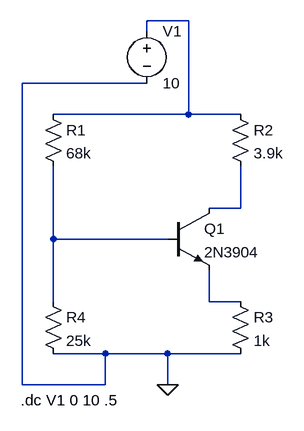
[diagram p0: schematic Lab6Pre1.asc]
Lab6Pre1.asc, the LTspice schematic file:
Version 4
SHEET 1 880 680
WIRE 272 -64 208 -64
WIRE 208 -48 208 -64
WIRE 208 32 16 32
WIRE 272 80 272 -64
WIRE 272 80 64 80
WIRE 352 80 272 80
WIRE 352 224 352 160
WIRE 352 224 304 224
WIRE 64 272 64 160
WIRE 240 272 64 272
WIRE 64 368 64 272
WIRE 304 368 304 320
WIRE 352 368 304 368
WIRE 144 448 64 448
WIRE 240 448 144 448
WIRE 352 448 240 448
WIRE 16 496 16 32
WIRE 144 496 144 448
WIRE 144 496 16 496
WIRE 240 496 240 448
FLAG 240 496 0
SYMBOL res 48 64 R0
SYMATTR InstName R1
SYMATTR Value 68k
SYMBOL res 336 64 R0
SYMATTR InstName R2
SYMATTR Value 3.9k
SYMBOL res 336 352 R0
SYMATTR InstName R3
SYMATTR Value 1k
SYMBOL res 48 352 R0
SYMATTR InstName R4
SYMATTR Value 25k
SYMBOL npn 240 224 R0
SYMATTR InstName Q1
SYMATTR Value 2N3904
SYMBOL voltage 208 -64 R0
WINDOW 123 0 0 Left 2
WINDOW 39 0 0 Left 2
SYMATTR InstName V1
SYMATTR Value 10
TEXT 14 520 Left 2 !.dc V1 0 10 .5

The netlist it stands for:
* Lab6Pre1.asc
R1 N001 N003 68k
R2 N001 N002 3.9k
R3 N004 0 1k
R4 N003 0 25k
Q1 N002 N003 N004 0 2N3904
V1 N001 0 10
.model NPN NPN
.model PNP PNP
.lib standard.bjt
.dc V1 0 10 .5
.backanno
.end